# EAGLE design Pico board (EAGLE 7.5.0)
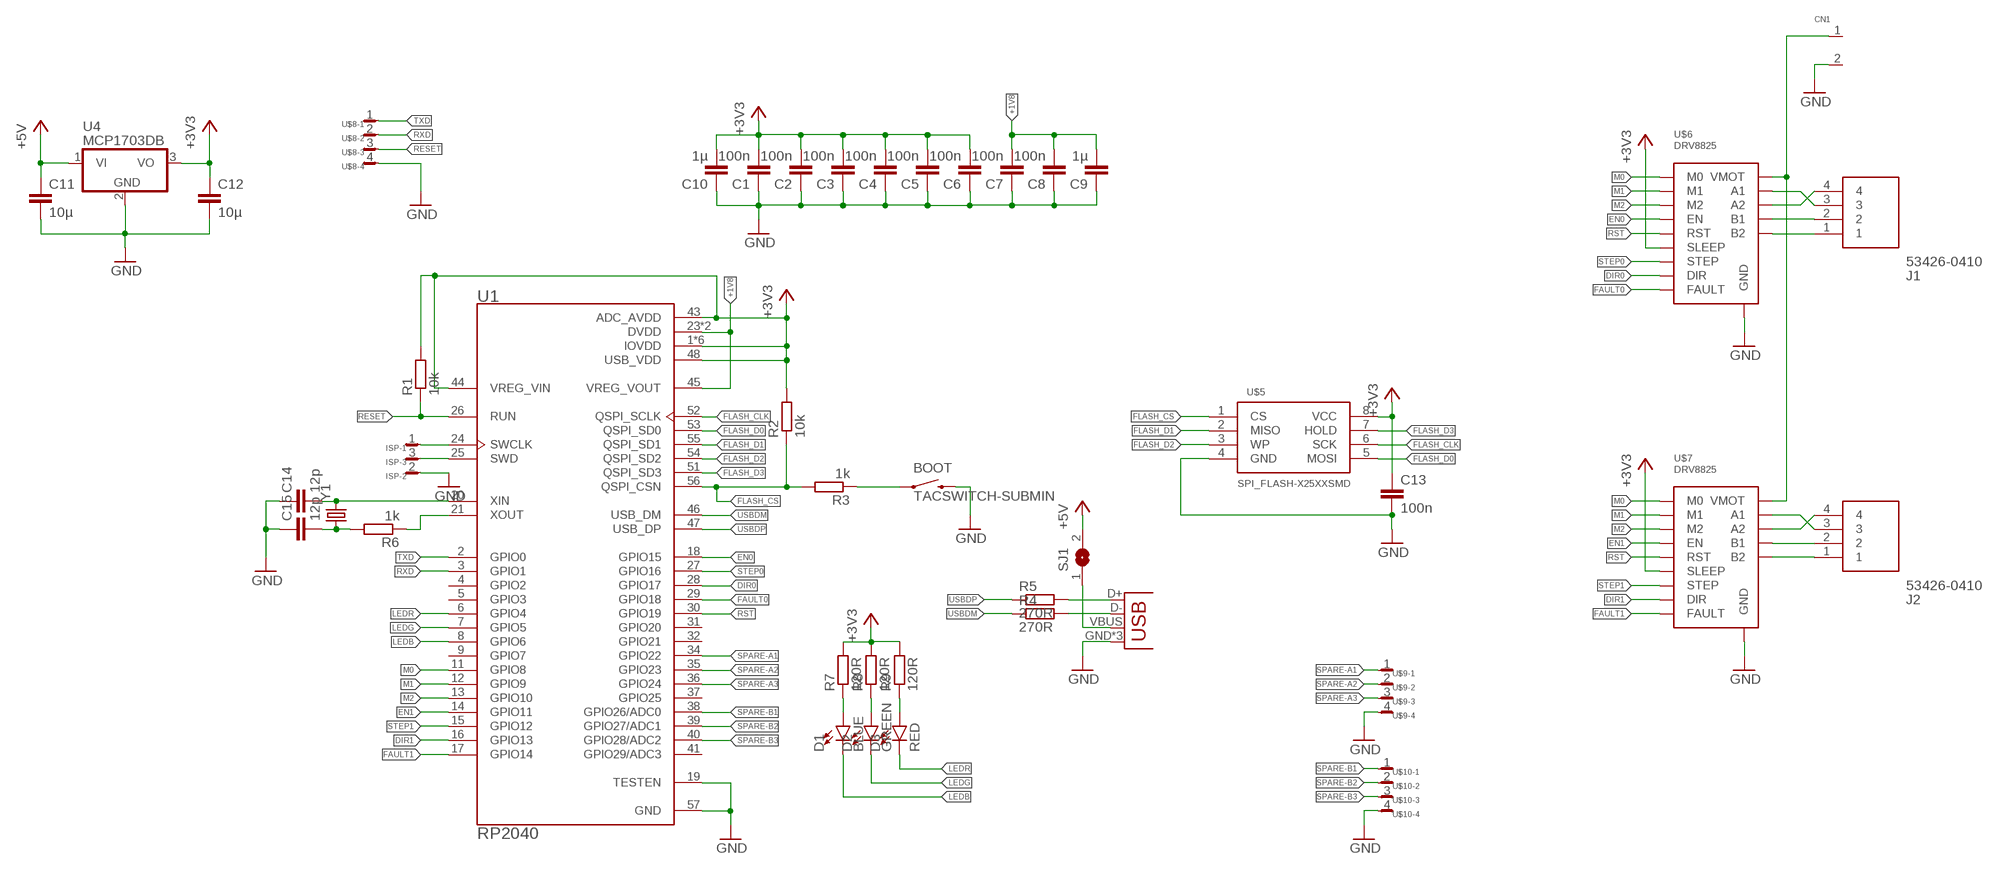
[diagram p0: schematic, sheet 1]

## Parts
BOOT  TACSWITCH-SUBMIN  [TACSWITCH_SUBMIN]
C1  100n  C-EUC0402K  [C0402K]
C2  100n  C-EUC0402K  [C0402K]
C3  100n  C-EUC0402K  [C0402K]
C4  100n  C-EUC0402K  [C0402K]
C5  100n  C-EUC0402K  [C0402K]
C6  100n  C-EUC0402K  [C0402K]
C7  100n  C-EUC0402K  [C0402K]
C8  100n  C-EUC0402K  [C0402K]
C9  1µ  C-EUC0603K  [C0603K]
C10  1µ  C-EUC0603K  [C0603K]
C11  10µ  C-EUC1206K  [C1206K]
C12  10µ  C-EUC1206K  [C1206K]
C13  100n  C-EUC0402K  [C0402K]
C14  12p  C-EUC0402K  [C0402K]
C15  12p  C-EUC0402K  [C0402K]
CN1  2PIN_SCREW_TRM  [CONN2P]
D1  BLUE  LED-BLUE0603  [LED-0603]
D2  GREEN  LED-GREEN0603  [LED-0603]
D3  RED  LED-RED0603  [LED-0603]
ISP  SM03B-SRSS-TB  [SM03B-SRSS-TB]
J1  53426-0410  [SHDRRA4W55P0X250_1X4_1240X1150]
J2  53426-0410  [SHDRRA4W55P0X250_1X4_1240X1150]
JP1  USB-MICROB  [USB-MICROB]
R1  10k  R-EU_R0402-*  [R0402]
R2  10k  R-EU_R0402-*  [R0402]
R3  1k  R-EU_R0402-*  [R0402]
R4  270R  R-EU_R0402-*  [R0402]
R5  270R  R-EU_R0402-*  [R0402]
R6  1k  R-EU_R0402-*  [R0402]
R7  120R  R-EU_R0402-*  [R0402]
R8  120R  R-EU_R0402-*  [R0402]
R9  120R  R-EU_R0402-*  [R0402]
SJ1  SJ  [SJ]
U1  RP2040  [QFN40P700X700X90-57N]
U4  MCP1703DB  [SOT223]
U$5  SPI_FLASH-X25XXSMD  [SO08]
U$6  DRV8825  POLOLU  [POLOLU]
U$7  DRV8825  POLOLU  [POLOLU]
U$8  SM04B-SRSS-TB  [SM04B-SRSS-TB]
U$9  SM04B-SRSS-TB  [SM04B-SRSS-TB]
U$10  SM04B-SRSS-TB  [SM04B-SRSS-TB]
Y1  CRYSTAL5X3  [CRYSTAL-SMD-5X3]

## Nets
+1V8: C7.2 C8.2 C9.2 U1.23(DVDD) U1.45(VREG_VOUT) U1.50(DVDD)
+3V3: C1.2 C2.2 C3.2 C4.2 C5.2 C6.2 C10.2 C12.1 C13.1 R1.2 R2.2 R7.2 R8.2 R9.2 U1.1(IOVDD) U1.10(IOVDD) U1.22(IOVDD) U1.33(IOVDD) U1.42(IOVDD) U1.43(ADC_AVDD) U1.44(VREG_VIN) U1.48(USB_VDD) U1.49(IOVDD) U4.3(VO) U$5.8(VCC) U$6.SLEEP U$7.SLEEP
+5V: C11.1 SJ1.2 U4.1(VI)
DIR0: U1.28(GPIO17) U$6.DIR
DIR1: U1.16(GPIO13) U$7.DIR
EN0: U1.18(GPIO15) U$6.ENABLE(EN)
EN1: U1.14(GPIO11) U$7.ENABLE(EN)
FAULT0: U1.29(GPIO18) U$6.FAULT
FAULT1: U1.17(GPIO14) U$7.FAULT
FLASH_CLK: U1.52(QSPI_SCLK) U$5.6(SCK)
FLASH_CS: R2.1 R3.2 U1.56(QSPI_CSN) U$5.1(CS)
FLASH_D0: U1.53(QSPI_SD0) U$5.5(MOSI)
FLASH_D1: U1.55(QSPI_SD1) U$5.2(MISO)
FLASH_D2: U1.54(QSPI_SD2) U$5.3(WP)
FLASH_D3: U1.51(QSPI_SD3) U$5.7(HOLD)
GND: BOOT.-2 C1.1 C2.1 C3.1 C4.1 C5.1 C6.1 C7.1 C8.1 C9.1 C10.1 C11.2 C12.2 C13.2 C14.1 C15.1 CN1.2 ISP.2 JP1.GND JP1.MT1(GND) JP1.MT2(GND) U1.19(TESTEN) U1.57(GND) U4.2(GND) U$5.4(GND) U$6.GND@1(GND) U$6.GND@2(GND) U$7.GND@1(GND) U$7.GND@2(GND) U$8.4 U$9.4 U$10.4
LEDB: D1.C U1.8(GPIO6)
LEDG: D2.C U1.7(GPIO5)
LEDR: D3.C U1.6(GPIO4)
M0: U1.11(GPIO8) U$6.M0 U$7.M0
M1: U1.12(GPIO9) U$6.M1 U$7.M1
M2: U1.13(GPIO10) U$6.M2 U$7.M2
N$5 [power]: J1.3 U$6.A1
N$6: JP1.D+ R5.2
N$7: JP1.D- R4.2
N$8 [power]: J1.4 U$6.A2
N$9: BOOT.-1 R3.1
N$10 [power]: J2.2 U$7.B1
N$11 [power]: J2.1 U$7.B2
N$12 [power]: J2.3 U$7.A1
N$13 [power]: J2.4 U$7.A2
N$16: JP1.VBUS SJ1.1
N$17: ISP.1 U1.24(SWCLK)
N$18: ISP.3 U1.25(SWD)
N$19: C15.2 R6.2 Y1.1
N$20: R6.1 U1.21(XOUT)
N$21: C14.2 U1.20(XIN) Y1.3
N$22 [power]: J1.2 U$6.B1
N$23 [power]: J1.1 U$6.B2
N$25: D1.A R7.1
N$26: D2.A R8.1
N$27 [power]: CN1.1 U$6.VMOT U$7.VMOT
N$28: D3.A R9.1
RESET: R1.1 U1.26(RUN) U$8.3
RST: U1.30(GPIO19) U$6.RESET(RST) U$7.RESET(RST)
RXD: U1.3(GPIO1) U$8.2
SPARE-A1: U1.34(GPIO22) U$9.1
SPARE-A2: U1.35(GPIO23) U$9.2
SPARE-A3: U1.36(GPIO24) U$9.3
SPARE-B1: U1.38(GPIO26/ADC0) U$10.1
SPARE-B2: U1.39(GPIO27/ADC1) U$10.2
SPARE-B3: U1.40(GPIO28/ADC2) U$10.3
STEP0: U1.27(GPIO16) U$6.STEP
STEP1: U1.15(GPIO12) U$7.STEP
TXD: U1.2(GPIO0) U$8.1
USBDM: R4.1 U1.46(USB_DM)
USBDP: R5.1 U1.47(USB_DP)
Unconnected: U1.4(GPIO2) U1.5(GPIO3) U1.9(GPIO7) U1.31(GPIO20) U1.32(GPIO21) U1.37(GPIO25) U1.41(GPIO29/ADC3)

## Library data of the parts
BOOT = melanie:TACSWITCH-SUBMIN
C1-C15 = melanie:C-EU: CAPACITOR, European symbol
CN1 = melanie:2PIN_SCREW_TRM
D1 = SparkFun-LED:LED-BLUE: Blue SMD LED Used in manufacturing of various products at SparkFun Packages: 0603 - SMD 0603 package [Product Link] <http://www.digikey.com/product-detail/en/SMLE12BC7TT86/511-1589-2-ND/1641808> 1206 - SMD1206 package [Product Link] <http://www.digikey.com/product-detail/en/lite-on-inc/LTST-C150TBKT/160-1643-1-ND/573584> SparkFun Products: ESP8266 Thing-Dev Board <https://www.sparkfun.com/products/13711> RedBoard <https://www.sparkfun.com/products/12757>; PROD_ID: DIO-08575
D2 = SparkFun-LED:LED-GREEN: Green SMD LED Used in manufacturing of various products at SparkFun Packages: 0603 - SMD 0603 package [Product Link] <http://www.futureelectronics.com/en/technologies/semiconductors/optoelectronics/leds/Pages/9894312-LTST-C190GKT.aspx?CrossPart=HSMG-C190&IM=0> LilyPad 1206 - SMD1206 LilyPad package [Product Link] <http://www.futureelectronics.com/en/Technologies/Product.aspx?ProductID=IN150NGHARVATEKCORPORATION2049943&IM=0> 1206 - SMD1206 package [Product Link] <http://www.futureelectronics.com/en/technologies/semiconductors/optoelectronics/leds/Pages/8315665-LTST-C150KGKT.aspx?IM=0> 1206 Bottom Mount -SMD 1206 Bottom Mount [Product Link] <http://www.digikey.com/product-detail/en/lite-on-inc/LTST-C230KGKT/160-1456-1-ND/386854> SparkFun Products: Pro Mini 328 -5V <https://www.sparkfun.com/products/821> RedBoard <https://www.sparkfun.com/products/12757> MP3 Trigger <https://www.sparkfun.com/products/13720> Makey Makey <https://www.sparkfun.com/products/11076>; PROD_ID: DIO-00821
D3 = SparkFun-LED:LED-RED: Red SMD LED Used in manufacturing of most products at SparkFun Packages: 0603 - SMD 0603 package [Product Link] <http://docs.avagotech.com/docs/AV02-0551EN> 0603 SMART - SMD 0603 SMART package ( more efficient and expensive)[Product Link] <http://www.osram-os.com/Graphics/XPic2/00077099_0.pdf> 1206 - SMD1206 package [Product Link] <https://www.sparkfun.com/datasheets/DevTools/LilyPad/Q150OVS4.pdff> SparkFun Products: Pro Mini 328 -5V <https://www.sparkfun.com/products/821> RedBoard <https://www.sparkfun.com/products/12757> IOIO-OTG <https://www.sparkfun.com/products/13613>; PROD_ID: DIO-00819
ISP = con-JST-SH:SM03B-SRSS-TB
J1 J2 = 53426-0410:53426-0410: Headers & Wire Housings 2.5 WTB WAFER ASSY RA W/KINK 4CKT Source: Datasheet <https://www.molex.com/pdm_docs/sd/534260410_sd.pdf>; DESCRIPTION: Headers & Wire Housings 2.5 WTB WAFER ASSY RA W/KINK 4CKT; HEIGHT: 6.9mm; MANUFACTURER_NAME: Molex; MANUFACTURER_PART_NUMBER: 53426-0410; MOUSER_PART_NUMBER: 538-53426-0410; MOUSER_PRICE-STOCK: https://www.mouser.co.uk/ProductDetail/Molex/53426-0410?qs=9BfFgGvh7CdBwfW5YnFZ7w%3D%3D
JP1 = SparkFun-Connectors:USB: USB Connectors USB-B-PTH is fully proven SKU : PRT-00139/CONN-08278 USB-miniB is fully proven SKU : PRT-00587 USB-A-PCB is untested. USB-A-H is throughly reviewed, but untested. Spark Fun Electronics SKU : PRT-00437 USB-B-SMT is throughly reviewed, but untested. Needs silkscreen touching up. USB-A-S has not been used/tested USB-MB-H has not been used/tested USB-MICROB has been used. CONN-09505; PROD_ID: CONN-09505
R1-R9 = melanie:R-EU_: RESISTOR, European symbol
SJ1 = jumper:SJ: SMD solder JUMPER
U1 = RP2040:RP2040: Check availability <https://pricing.snapeda.com/parts/RP2040/Raspberry%20Pi/view-part?ref=eda>; AVAILABILITY: In Stock; CHECK_PRICES: https://www.snapeda.com/parts/RP2040/Raspberry+Pi/view-part/?ref=eda; DESCRIPTION: RP2040 chip for Raspberry Pi Pico - ARM® Cortex®-M0+ MCU 32-Bit; MF: Raspberry Pi; MP: RP2040; PACKAGE: None; PRICE: None; PURCHASE-URL: https://www.snapeda.com/api/url_track_click_mouser/?unipart_id=5800506&manufacturer=Raspberry Pi&part_name=RP2040&search_term=None; SNAPEDA_LINK: https://www.snapeda.com/parts/RP2040/Raspberry+Pi/view-part/?ref=snap
U4 = linear:MCP1703: 250 mA, 16V, Low Quiescent Current LDO Regulator Source: http://ww1.microchip.com/downloads/en/DeviceDoc/22049b.pdf
U$5 = SparkFun-DigitalIC:SPI_FLASH-X25XX: 8pin SPI Flash series x25xx. Works with devices like W25X32 and BR25L32
U$6 U$7 = melanie:POLOLU
U$8-U$10 = con-JST-SH:SM04B-SRSS-TB
Y1 = SparkFun-FreqCtrl:CRYSTAL: Various standard crystals. Proven footprints. Spark Fun Electronics SKU : COM-00534

## Net classes
1 power: width 1 mm

## Board
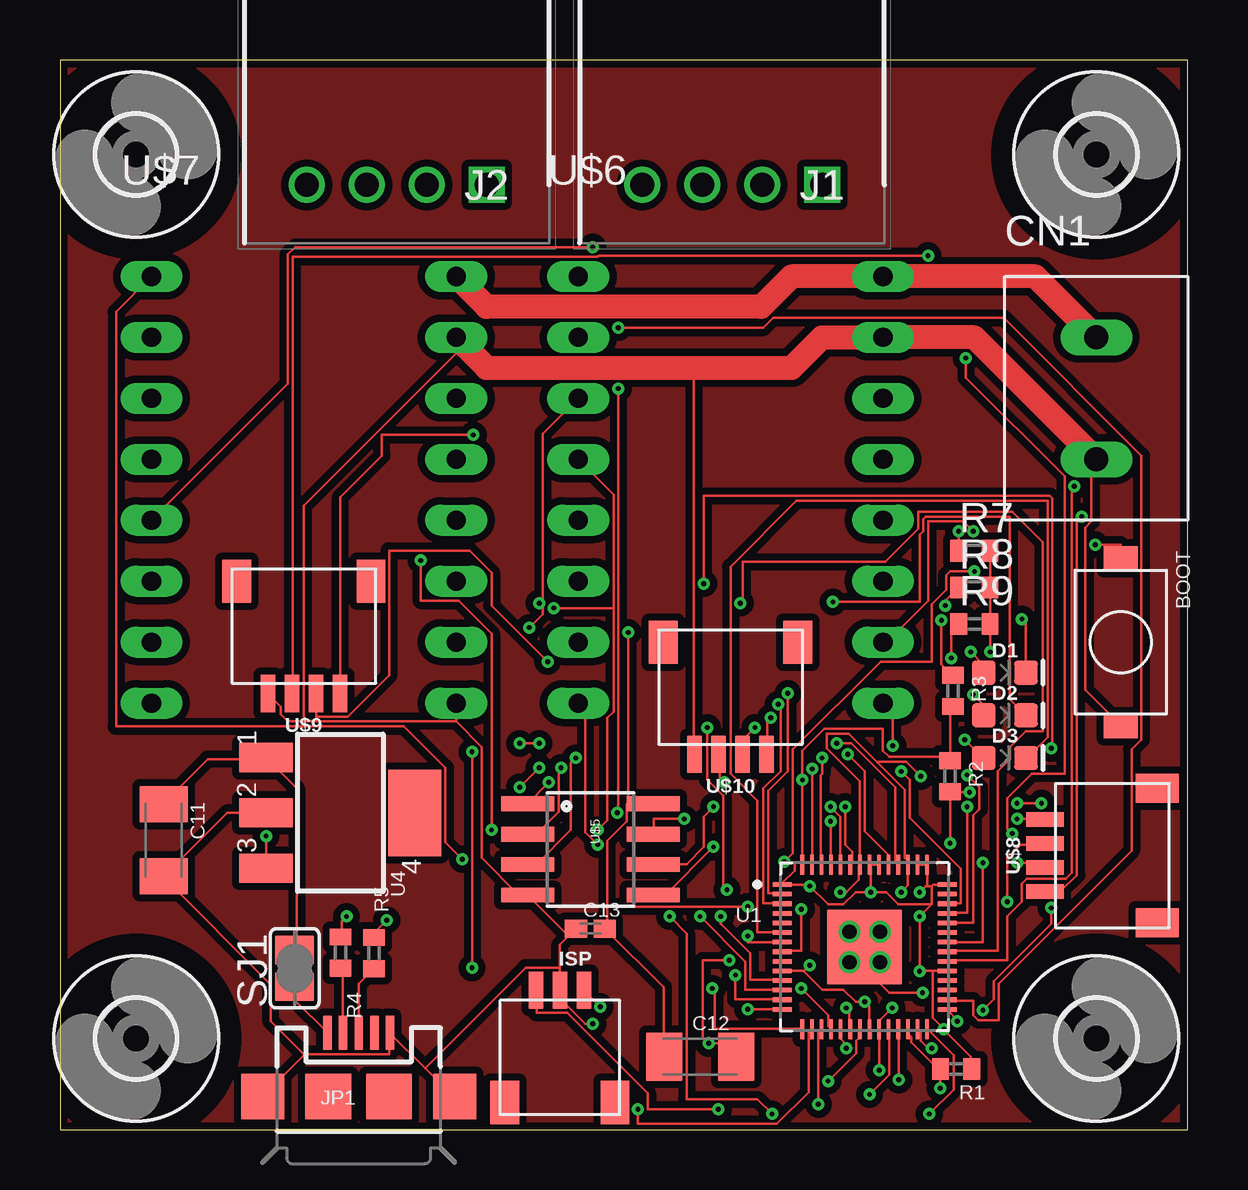
[diagram p1: board, top side]
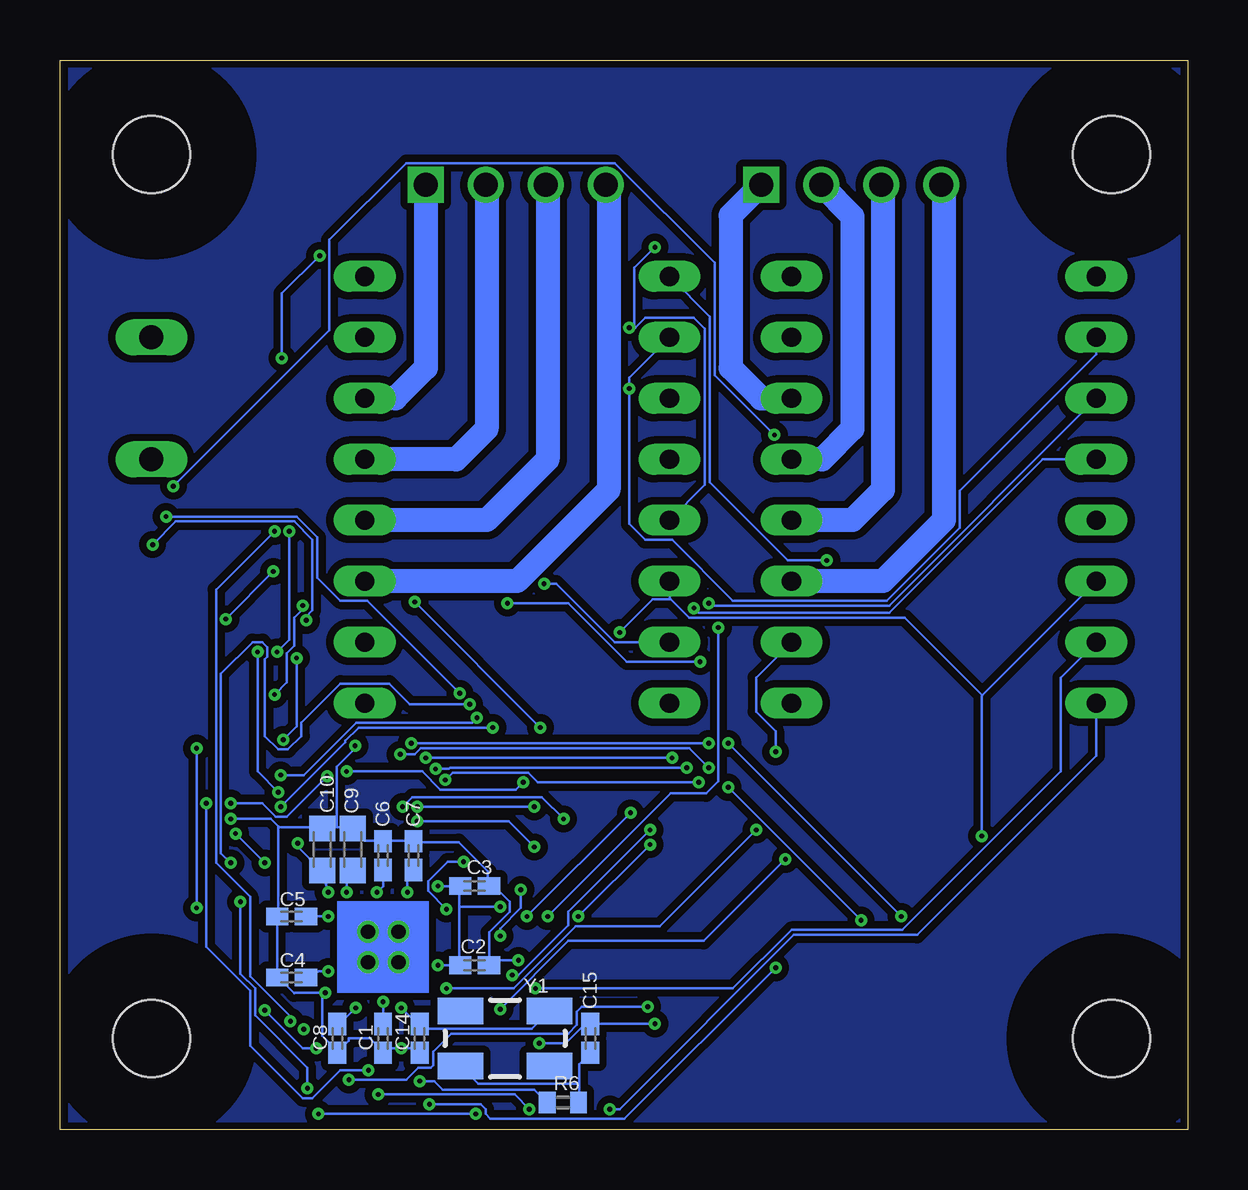
[diagram p2: board, bottom side, seen from below]

Size 46.99 x 44.58 mm. Coordinates in mm from the lower left corner, seen from the top.
Outline: 0,0 46.99,0 46.99,44.58 0,44.58 0,0
Copper layers (1*16): Top 0.035mm / dielectric 1.5mm / Bottom 0.035mm
Design rules "aisler_2_layer": minimum track width 0.1mm, minimum drill 0.2mm, track to track 0.1mm, track to pad 0.1mm, pad to pad 0.1mm, via to via 0.1mm, smd to smd 0.1mm, copper to edge 0.2mm, drill to drill 0.21mm, minimum pad ring 0.25mm, minimum via ring 0.15mm, stop-mask expansion 0mil, vias tented up to drill 0mil, thermal gap 10mil

### Footprints (pad centres in the part's own frame; a part is rotated, then mirrored left to right if it is on the bottom)
TACSWITCH_SUBMIN = smd 1 x 1.4: -1 -3.5,0; -2 3.5,0
C0402K = smd 0.925 x 0.74: 1 -0.6,0; 2 0.6,0
C0603K = smd 1.05 x 1.08: 1 -0.875,0; 2 0.875,0
C1206K = smd 1.5 x 2: 1 -1.5,0; 2 1.5,0
CONN2P = drill 1 long: 1 0,2.54; 2 0,-2.54
LED-0603 = smd 1 x 1: A -0.877,0; C 0.877,0
SM03B-SRSS-TB = smd 0.6 x 1.55: 1 -1,4.675; 2 0,4.675; 3 1,4.675 | smd 1.2 x 1.8: M1 2.3,0; M2 -2.3,0
SHDRRA4W55P0X250_1X4_1240X1150 = drill 1 pad 1.5 square: 1 0,0 | drill 1 pad 1.5: 2 -2.5,0; 3 -5,0; 4 -7.5,0
USB-MICROB = smd 0.35 x 1.4: D+ 0,2.65; D- -0.65,2.65; GND 1.3,2.65; ID 0.65,2.65; VBUS -1.3,2.65 | smd 1.8 x 1.9: MT1 -4,0; MT2 4,0 | smd 1.9 x 1.9: P$1 -1.27,0; P$2 1.27,0
R0402 = smd 0.7 x 0.9: 1 -0.65,0; 2 0.65,0
SJ = smd 1.168 x 1.6: 1 -0.762,0; 2 0.762,0
QFN40P700X700X90-57N = smd 0.84 x 0.2: 1 -3.435,2.6; 2 -3.435,2.2; 3 -3.435,1.8; 4 -3.435,1.4; 5 -3.435,1; 6 -3.435,0.6; 7 -3.435,0.2; 8 -3.435,-0.2; 9 -3.435,-0.6; 10 -3.435,-1; 11 -3.435,-1.4; 12 -3.435,-1.8; 13 -3.435,-2.2; 14 -3.435,-2.6; 29 3.435,-2.6; 30 3.435,-2.2; 31 3.435,-1.8; 32 3.435,-1.4; 33 3.435,-1; 34 3.435,-0.6; 35 3.435,-0.2; 36 3.435,0.2; 37 3.435,0.6; 38 3.435,1; 39 3.435,1.4; 40 3.435,1.8; 41 3.435,2.2; 42 3.435,2.6 | smd 0.2 x 0.84: 15 -2.6,-3.435; 16 -2.2,-3.435; 17 -1.8,-3.435; 18 -1.4,-3.435; 19 -1,-3.435; 20 -0.6,-3.435; 21 -0.2,-3.435; 22 0.2,-3.435; 23 0.6,-3.435; 24 1,-3.435; 25 1.4,-3.435; 26 1.8,-3.435; 27 2.2,-3.435; 28 2.6,-3.435; 43 2.6,3.435; 44 2.2,3.435; 45 1.8,3.435; 46 1.4,3.435; 47 1,3.435; 48 0.6,3.435; 49 0.2,3.435; 50 -0.2,3.435; 51 -0.6,3.435; 52 -1,3.435; 53 -1.4,3.435; 54 -1.8,3.435; 55 -2.2,3.435; 56 -2.6,3.435 | smd 3.1 x 3.1: 57 0,0
SOT223 = smd 1.219 x 2.235: 1 -2.311,-3.099; 2 0,-3.099; 3 2.311,-3.099 | smd 3.6 x 2.2: 4 0,3.099
3,2 = hole 3.2: 0,0
SO08 = smd 0.61 x 2.21: 1 -1.905,-2.616; 2 -0.635,-2.616; 3 0.635,-2.616; 4 1.905,-2.616; 5 1.905,2.616; 6 0.635,2.616; 7 -0.635,2.616; 8 -1.905,2.616
POLOLU = drill 0.8 long: A1 6.35,-2.54; A2 6.35,-5.08; B1 6.35,0; B2 6.35,2.54; DIR -6.35,-10.16; ENABLE -6.35,7.62; FAULT 6.35,-7.62; GND@1 6.35,5.08; GND@2 6.35,-10.16; M0 -6.35,5.08; M1 -6.35,2.54; M2 -6.35,0; RESET -6.35,-2.54; SLEEP -6.35,-5.08; STEP -6.35,-7.62; VMOT 6.35,7.62
SM04B-SRSS-TB = smd 0.6 x 1.55: 1 -1.5,4.675; 2 -0.5,4.675; 3 0.5,4.675; 4 1.5,4.675 | smd 1.2 x 1.8: M1 2.8,0; M2 -2.8,0
CRYSTAL-SMD-5X3 = smd 1.9 x 1.1: 1 -1.85,-1.15; 2 1.85,-1.15; 3 1.85,1.15; 4 -1.85,1.15

### Placement (x,y rotation side)
BOOT  44.2,20.32 270 top
C1  33.53,3.81 90 bottom
C2  29.72,6.86 180 bottom
C3  29.72,10.16 180 bottom
C4  37.34,6.35 0 bottom
C5  37.34,8.89 0 bottom
C6  33.53,11.43 270 bottom
C7  32.26,11.43 270 bottom
C8  35.43,3.81 90 bottom
C9  34.8,11.68 270 bottom
C10  36.07,11.68 270 bottom
C11  4.32,12.06 270 top
C12  26.67,3.05 0 top
C13  22.1,8.38 180 top
C14  32,3.81 90 bottom
C15  24.89,3.81 270 bottom
CN1  43.18,30.48 0 top
D1  39.37,19.05 0 top
D2  39.37,17.27 0 top
D3  39.37,15.49 0 top
ISP  20.83,1.14 0 top
J1  31.75,39.37 0 top
J2  17.78,39.37 0 top
JP1  12.45,1.4 0 top
R1  37.34,2.54 0 top
R2  37.08,14.73 270 top
R3  37.21,18.29 270 top
R4  11.68,7.38 270 top
R5  13.08,7.37 270 top
R6  26.04,1.14 0 bottom
R7  38.1,24.13 0 top
R8  38.1,22.61 0 top
R9  38.1,21.08 0 top
SJ1  9.78,6.73 90 top
U1  33.53,7.62 0 top
U4  11.68,13.21 270 top
U$1  [3,2]  43.18,40.64 0 top
U$2  [3,2]  3.18,40.64 0 top
U$3  [3,2]  43.18,3.81 0 top
U$4  [3,2]  3.18,3.81 0 top
U$5  22.1,11.68 270 top
U$6  27.94,27.94 0 top
U$7  10.16,27.94 0 top
U$8  45.72,11.43 90 top
U$9  10.16,22.86 180 top
U$10  27.94,20.32 180 top
Y1  28.45,3.81 0 bottom

### Tracks (layer width: path | path; a pad name or v marks a point on that pad's centre or on a via)
+1V8  (via drill 0.2)
  Top 0.1: v32.51,9.91 32.77,9.91 33.27,10.41 33.27,11 U1.50 | v35.05,9.91 35.33,10.18 U1.45 | 35.31,11.18 U1.45 | 33.4,11.18 U1.50 | v34.67,5.08 34.16,4.57 34.16,4.19 U1.23 | 34.16,4.06 U1.23 | 34.06,15.32 32.87,16.51 31.95,16.51 31.95,15.9 33.33,14.53 33.33,11.12 U1.50 | 34.06,15.32 35.2,14.17 35.2,11.33 35.31,11.23 U1.45 | v34.14,2.49 34.14,4.06 U1.23 | v39.88,13.61 v40.89,13.61 | v35.87,14.73 35.26,15.34 34.09,15.34 34.06,15.32
  Bottom 0.1: 32.51,10.16 v32.51,9.91 32.51,10.58 C7.2 32.26,10.92 | v35.05,9.91 35.05,10.55 C9.2 34.8,10.92 | v34.67,5.08 35.43,4.32 C8.2 | v34.14,2.49 35.31,2.49 36.47,1.32 36.88,1.32 39.07,3.5 39.07,5.79 40.89,7.62 v40.89,13.61 | v39.88,13.61 38.56,13.61 38,13.06 37.54,13.06 v35.87,14.73
+3V3  (via drill 0.2)
  Top 0.1: v33.78,9.91 33.78,11 U1.49 U1.48 34.16,11.18 | v35.81,9.91 36.07,10.16 | 36.07,10.16 36.13,10.22 U1.43 U1.44 | 36.32,9.4 v35.81,8.89 v35.81,6.6 35.83,6.62 36.37,6.62 | 36.32,9.4 36.32,10.16 | 36.32,10.16 36.38,10.22 U1.42 | 36.37,6.62 U1.33 37.08,6.6 | v31.24,6.86 31,6.62 30.99,6.62 | 30.99,6.62 U1.10 | 36.07,10.16 36.32,10.16 | v33.78,9.91 34.42,9.91 34.93,9.4 36.32,9.4 | v33.78,9.91 33.15,9.91 32.64,9.4 32,9.4 v31.24,10.16 31.18,10.22 U1.1 30.1,10.29 30.61,10.79 30.61,11.05 | 30.99,6.62 30.99,6.6 31.75,5.84 32.64,5.84 33.15,5.33 v33.53,5.33 33.73,5.13 U1.22 33.78,4.06 33.78,3.81 | v8.59,12.24 U4.3 | C12.1 25.15,3.05 25.15,5.94 C13.1 22.81,8.33 22.81,9.3 | 23.67,13.56 23.62,13.56 23.62,12.85 22.81,12.04 22.81,9.3 | 23.67,13.56 24.69,13.56 U$5.8 23.67,13.56 | R8.2 R9.2 | R8.2 R7.2 | R8.2 | R1.2 37.95,2.54 37.95,3.05 36.83,4.17 v36.83,4.19 36.83,4.22 36.37,4.67 36.37,6.62 | v37.08,11.94 R2.2 | v38.76,19.91 R9.2 | R2.2 v37.9,14.07 | R9.2 | R2.2 | v28.65,9.3 22.81,9.3 | 23.67,13.56 v23.67,20.73
  Bottom 0.1: C6.2 33.53,10.16 v33.78,9.91 | C10.2 v35.81,9.91 | C5.2 v35.81,8.89 | v35.81,6.6 36.21,6.6 C4.2 36.83,6.35 | C1.2 v33.53,5.33 | 30.35,6.86 v31.24,6.86 | 30.35,10.16 v31.24,10.16 | 30.35,10.16 30.35,9.3 | 30.35,9.3 30.35,6.86 | 30.35,6.86 C2.2 30.23,6.86 | 30.35,10.16 C3.2 30.23,10.16 | 35.94,10.41 C10.2 | v8.59,12.24 8.59,18.09 8.56,18.11 | U$7.SLEEP 8.56,18.11 | U$6.SLEEP 21.59,22.15 21.57,22.12 | 21.57,22.12 20.78,21.34 11.79,21.34 8.56,18.11 | v37.08,11.94 37.08,11.79 36.12,10.82 C10.2 | v38.76,19.91 38.76,14.94 v37.9,14.07 | 30.35,9.3 v28.65,9.3 | v23.67,20.73 22.3,22.1 21.59,22.1 21.57,22.12
+5V
  Top 0.1: SJ1.2 9.86,7.57 9.86,14.22 8.59,15.49 U4.1 8.59,15.44 6.15,15.44 4.32,13.61 C11.1
DIR0  (via drill 0.2)
  Top 0.1: v36.22,0.66 37.24,1.68 37.24,3.1 36.17,4.17 U1.28 | v29.67,0.66 29.06,1.27 26.11,1.27 26.11,8.18 v25.4,8.89 | v22.4,11.89 21.9,12.39 21.9,17.48 U$6.DIR
  Bottom 0.1: v29.67,0.66 v36.22,0.66 | v22.4,11.89 v25.4,8.89
DIR1  (via drill 0.2)
  Top 0.1: v24.08,0.86 24.08,0.25 29.87,0.25 31.19,1.57 31.19,4.06 31.29,4.17 U1.16
  Bottom 0.1: v24.08,0.86 23.67,0.86 16.41,8.13 11.28,8.13 3.81,15.6 U$7.DIR
EN0  (via drill 0.2)
  Top 0.1: v30.89,5.89 32,4.78 32,4.32 32.11,4.22 U1.18 | v17.98,12.5 17.98,20.68 16.61,22.05 15.04,22.05 v15.04,23.72
  Bottom 0.1: v30.89,5.89 28.09,5.89 25.5,8.48 22,8.48 v17.98,12.5 | v15.04,23.72 16.66,23.72 19.91,26.98 19.91,33.88 U$6.ENABLE
EN1  (via drill 0.2)
  Top 0.1: v28.65,5.03 30.07,5.03 U1.14 | v16.76,11.28 16.05,11.99 16.05,15.09 14.33,16.82 2.34,16.82 2.34,34.09 U$7.ENABLE
  Bottom 0.1: v28.65,5.03 25.81,7.87 20.17,7.87 v16.76,11.28
FAULT0  (via drill 0.2)
  Top 0.1: v37.39,4.52 37.39,4.57 36.98,4.98 U1.29 | v38.05,24.94 37.64,25.35 36.17,25.35 36.17,22.05 34.44,20.32 U$6.FAULT
  Bottom 0.1: v37.39,4.52 37.39,4.72 39.07,6.4 39.07,9.7 40.49,11.12 40.49,22.5 v38.05,24.94
FAULT1  (via drill 0.2)
  Top 0.1: v31.6,1.07 31.6,4.06 31.7,4.17 U1.17 | v17.17,15.75 v17.17,6.76
  Bottom 0.1: v31.6,1.07 29.46,1.07 29.26,0.86 29.26,0.66 29.06,0.46 23.47,0.46 v17.17,6.76 | v17.17,15.75 17.17,16.61 17.98,17.42 17.98,18.85 U$7.FAULT
FLASH_CLK  (via drill 0.2)
  Top 0.1: v32.11,13.46 32.51,13.06 32.51,11.18 U1.52 | v27.23,13.46 26.82,13.06 26.82,11.79 26.11,11.07 24.74,11.07 U$5.6
  Bottom 0.1: v27.23,13.46 v32.11,13.46
FLASH_CS  (via drill 0.2)
  Top 0.1: 37.08,15.54 34.54,15.54 34.29,15.8 34.29,16.71 31.85,16.71 30.94,15.8 v30.94,14.58 30.94,11.07 U1.56 | 37.08,15.54 R2.1 37.08,15.39 | 37.08,15.54 37.08,17.53 37.19,17.63 R3.2 | v20.37,14.48 U$5.1
  Bottom 0.1: v20.37,14.48 27.08,14.48 27.48,14.88 30.63,14.88 v30.94,14.58
FLASH_D0  (via drill 0.2)
  Top 0.1: 32.13,11.18 U1.53 32.11,11.18 v32.11,12.85 | v27.23,11.79 25.25,9.8 24.74,9.8 U$5.5
  Bottom 0.1: v32.11,12.85 28.3,12.85 v27.23,11.79
FLASH_D1  (via drill 0.2)
  Top 0.1: v31.34,15.04 31.34,11.07 U1.55 | v20.88,15.09 20.78,14.99 20.78,13.26 19.86,12.34 19.51,12.34 U$5.2
  Bottom 0.1: v31.34,15.04 30.79,15.04 30.73,15.09 v20.88,15.09
FLASH_D2  (via drill 0.2)
  Top 0.1: 31.75,11.18 U1.54 31.75,11.23 31.7,11.28 31.7,14.78 31.75,14.83 v31.75,15.49 | v21.49,15.49 21.29,15.29 21.29,12.5 19.86,11.07 19.51,11.07 U$5.3
  Bottom 0.1: v21.49,15.49 v31.75,15.49
FLASH_D3  (via drill 0.2)
  Top 0.1: U1.51 33.02,11.18 33.02,11.58 32.72,11.89 v32.72,13.46 | v26.01,12.95 24.74,12.95 24.74,12.34 U$5.7
  Bottom 0.1: v32.72,13.46 32.31,13.87 26.92,13.87 v26.01,12.95
GND  (via drill 0.2)
  Top 0.1: 32.51,4.57 32.51,4.19 U1.19 | 32.51,3.81 32.51,4.06 U1.19 | U1.57 33.53,6.73 34.54,5.71 v35.94,5.71 | BOOT.-2 44.2,16.87 42.72,18.34 42.72,25.09 42.98,25.35 42.98,27.48 CN1.2 | 26.42,31.75 26.42,15.65 U$10.4 | 32.51,3.81 32.77,3.56 v32.77,3.4 | 32.51,3.81 U1.19 | v39.88,12.95 41,12.95 U$8.4 | U$6.GND@2 34.7,17.37 v34.7,16 | U4.2 6.96,13.21 C11.2 4.32,10.52 8.79,6.04 8.79,4.52 10.19,3.12 | 15.22,2.56 16.41,1.37 JP1.MT2 | 15.22,2.56 13.77,4.01 JP1.GND 13.72,4.01 13.72,3.15 10.21,3.15 10.19,3.12 | 10.19,3.12 8.48,1.42 JP1.MT1 | 16.51,17.02 10.16,17.02 | 10.16,17.02 9.5,17.02 9.2,17.32 9.2,17.63 8.69,18.14 U$9.4 | U$7.GND@2 16.51,17.02 | C12.2 28.14,3.05 28.14,3.61 v27.03,3.61 26.77,3.86 26.77,7.06 v27.89,7.06 | 20.83,6.76 ISP.2 20.83,5.49 21.9,4.42 v22.2,4.42 | 20.83,6.76 20.83,7.72 21.49,8.38 C13.2 21.13,8.08 21.13,8.13 U$5.4 19.46,9.8 19.1,9.8 17.58,11.33 17.58,15.95 16.51,17.02 | 15.22,2.56 19.41,6.76 20.83,6.76 | 16.84,32.69 10.16,26.01 10.16,17.02
  Top 1: CN1.2 38.1,33.02 U$6.GND@1 31.75,33.02 30.48,31.75 26.42,31.75 17.78,31.75 16.84,32.69 U$7.GND@1
  Bottom 0.1: 36.07,5.71 37.21,5.71 37.24,5.69 37.9,6.35 C4.1 C5.1 37.9,8.89 37.9,12.6 37.87,12.62 | 36.07,5.71 36.07,3.91 35.41,3.25 | 36.07,5.71 v35.94,5.71 | 34.09,3.81 34.95,3.81 34.95,3.71 35.41,3.25 | 34.09,3.81 34.04,3.81 | C14.1 32,3.25 32.16,3.4 v32.77,3.4 33.63,3.4 C1.1 33.53,3.25 34.09,3.81 | 35.41,3.25 C8.1 | 29.11,7.06 29.11,8.23 28.25,9.09 28.25,9.5 28.91,10.16 C3.1 29.16,10.16 29.16,10.77 30.38,11.99 32.26,11.99 C7.1 C6.1 | 29.11,7.06 29.11,6.86 C2.1 29.11,7.06 | 36.07,12.6 35.46,12.6 | 35.46,12.6 34.8,12.6 C9.1 34.8,12.55 34.29,12.04 C6.1 | C6.1 | v39.88,12.95 38.2,12.95 37.87,12.62 | 37.87,12.62 37.85,12.6 36.07,12.6 | 36.07,12.6 C10.1 | v34.7,16 34.7,15.9 35.46,15.14 35.46,12.6 | v27.03,3.61 25.91,3.61 25.15,4.37 24.89,4.37 C15.1 v22.2,4.42 | v27.89,7.06 29.11,7.06
LEDB  (via drill 0.2)
  Top 0.1: v30.89,9.2 30.89,7.47 30.12,7.47 U1.8 | v30.18,11.18 30.53,11.53 30.53,15.85 34.19,19.51 36.32,19.51 36.32,21.89 36.93,22.5 36.93,23.11 37.08,23.27 v38.1,23.27 | v40.08,21.29 40.23,21.13 40.23,19.05 D1.C
  Bottom 0.1: v30.89,9.2 31.65,9.96 31.65,10.36 30.84,11.18 v30.18,11.18 | v40.08,21.29 v38.1,23.27
LEDG  (via drill 0.2)
  Top 0.1: v28.65,8.08 28.65,7.82 30.07,7.82 U1.7 | v27.79,10.01 27.63,10.16 27.63,13.92 26.98,14.58 v26.98,16.76 | v32.21,22 35.81,22 35.81,24.79 35.97,24.94 35.97,25.45 36.07,25.55 39.57,25.55 39.57,17.93 40.23,17.27 D2.C
  Bottom 0.1: v28.65,8.08 28.65,8.38 27.79,9.25 v27.79,10.01 | v32.21,22 v26.98,16.76
LEDR
  Top 0.1: U1.6 30.07,8.23 29.06,8.23 29.06,13.72 27.94,14.83 27.94,23.47 30.68,26.21 41.15,26.21 41.15,16.36 40.28,15.49 D3.C
M0  (via drill 0.2)
  Top 0.1: v27.53,8.89 27.53,8.59 28.75,7.37 28.75,6.25 30.07,6.25 U1.11 | v23.22,13.21 23.27,13.26 v23.27,30.89
  Bottom 0.1: v23.22,13.21 v27.53,8.89 | U$6.M0 23.27,31.34 v23.27,30.89 23.27,25.25 22.61,24.59 21.49,24.59 18.95,22.05 12.55,22.05 9.5,25.09 9.5,26.62 3.81,32.31 U$7.M0
M1  (via drill 0.2)
  Top 0.1: v26.67,8.89 28.55,7.01 28.55,5.84 30.07,5.84 U1.12 | v19.56,20.93 20.12,21.49 20.12,21.95 | 20.12,21.95 20.12,29.01 U$6.M1 | 20.12,21.95 v19.96,21.95
  Bottom 0.1: v26.67,8.89 21.54,14.02 20.07,14.02 19.56,14.53 v19.56,20.93 | U$7.M1 12.45,21.84 19.86,21.84 v19.96,21.95
M2  (via drill 0.2)
  Top 0.1: v28.14,6.45 28.14,5.44 30.07,5.44 U1.13 | v22.4,12.5 22.81,12.9 22.81,17.17 23.06,17.42 23.06,21.74 | 23.06,21.74 23.06,26.47 U$6.M2 | 23.06,21.74 v20.57,21.74
  Bottom 0.1: v28.14,6.45 27.89,6.45 25.81,8.53 25.81,9.09 v22.4,12.5 | U$7.M2 6.05,27.94 12.45,21.54 20.37,21.54 v20.57,21.74
N$1  (via drill 0.6)
  other vias: 32.89,8.26
N$2  (via drill 0.6)
  other vias: 34.16,8.26
N$3  (via drill 0.6)
  other vias: 34.16,6.99
N$4  (via drill 0.6)
  other vias: 32.89,6.99
N$5
  Bottom 1: J1.3 26.67,39.29 26.67,27.94 29.21,25.4 U$6.A1
N$6
  Top 0.1: JP1.D+ 12.45,6.1 13.06,6.71 R5.2
N$7
  Top 0.1: R4.2 11.73,6.71 11.79,6.66 11.79,4.06 JP1.D-
N$8
  Bottom 1: J1.4 24.13,39.25 24.13,26.67 27.94,22.86 U$6.A2
N$9  (via drill 0.2)
  Top 0.1: v36.73,21.23 36.73,19.41 37.19,18.95 R3.1 | v43.13,24.38 44.2,24.38 BOOT.-1
  Bottom 0.1: v36.73,21.23 36.73,21.39 36.47,21.64 36.47,24.59 37.24,25.35 42.16,25.35 v43.13,24.38
N$10
  Bottom 1: J2.2 13.97,38.06 13.97,29.21 15.24,27.94 U$7.B1
N$11
  Bottom 1: J2.1 19.05,38.1 19.05,31.75 17.78,30.48 U$7.B2
N$12
  Bottom 1: J2.3 12.7,39.29 12.7,26.67 13.97,25.4 U$7.A1
N$13
  Bottom 1: J2.4 10.16,39.25 10.16,25.4 12.7,22.86 U$7.A2
N$14
  pour Bottom (isolate 0.305): 0,0 46.61,0 46.61,44.45 0,44.45
N$15
  pour Top (isolate 0.305): 0,0 46.61,0 46.61,44.45 0,44.45
N$16
  Top 0.1: JP1.VBUS 11.12,4.06 9.8,5.38 9.8,5.94 SJ1.1
N$17  (via drill 0.2)
  Top 0.1: v33.73,1.47 34.54,2.29 34.54,4.06 U1.24 | v27.43,0.86 24.49,0.86 24.49,1.52 21.13,4.88 19.86,4.88 19.86,5.79 ISP.1
  Bottom 0.1: v33.73,1.47 28.04,1.47 v27.43,0.86
N$18  (via drill 0.2)
  Top 0.1: 34.93,4.06 U1.25 34.95,4.06 v34.95,2.08 | v22.5,5.13 21.84,5.79 ISP.3
  Bottom 0.1: v34.95,2.08 32.56,2.08 32.05,2.59 31.55,2.59 31.45,2.69 31.45,3.25 30.68,4.01 25.81,4.01 25.45,4.37 25.45,4.93 25.25,5.13 v22.5,5.13
N$19
  Bottom 0.1: 25.35,1.93 25.35,2.74 C15.2 | 25.35,1.93 25.35,1.17 R6.2 | 25.35,1.93 29.57,1.93 30.28,2.64 Y1.1
N$20  (via drill 0.2)
  Top 0.1: 33.27,3.81 33.27,4.06 U1.21 33.27,3.81 | 33.27,3.81 33.17,3.71 33.17,3.2 v32,2.03
  Bottom 0.1: v32,2.03 31.39,2.03 31.04,1.68 27.23,1.68 26.72,1.17 R6.1
N$21  (via drill 0.2)
  Top 0.1: v32.77,5.08 32.89,4.95 32.89,4.19 U1.20
  Bottom 0.1: 32,4.32 v32.77,5.08 | 32,4.32 31.88,4.19 C14.2 | 32,4.32 C14.2 | C14.2 31.85,4.22 27.33,4.22 26.62,4.93 Y1.3
N$22
  Bottom 1: J1.2 29.21,39.33 29.21,29.21 30.48,27.94 U$6.B1
N$23
  Bottom 1: J1.1 31.75,31.75 33.02,30.48 U$6.B2
N$25  (via drill 0.2)
  Top 0.1: v37.44,24.94 R7.1 | v37.95,19.91 38.46,19.41 38.46,19.05 D1.A
  Bottom 0.1: v37.44,24.94 37.44,20.42 v37.95,19.91
N$26  (via drill 0.2)
  Top 0.1: v36.88,21.84 36.88,22.05 R8.1 | v38.05,18.14 38.46,17.73 38.46,17.27 D2.A
  Bottom 0.1: v36.88,21.84 36.88,21.69 37.24,21.34 37.24,20.17 37.54,19.86 37.54,18.64 v38.05,18.14
N$27
  Top 1: CN1.1 40.64,35.56 U$6.VMOT 30.48,35.56 29.21,34.29 17.78,34.29 U$7.VMOT
N$28  (via drill 0.2)
  Top 0.1: v37.13,19.66 37.13,20.78 R9.1 | v37.69,16.26 38.46,15.49 D3.A
  Bottom 0.1: v37.13,19.66 37.13,16.82 v37.69,16.26
RESET  (via drill 0.2)
  Top 0.1: 35.31,4.06 U1.26 35.31,4.01 35.46,3.86 35.46,3.66 36.58,2.54 36.68,2.54 | v36.68,1.73 36.68,2.54 | v39.47,9.5 39.47,11.33 40.03,11.89 41,11.89 U$8.3 | 36.68,2.54 R1.1
  Bottom 0.1: v36.68,1.73 36.68,2.59 38.86,4.78 38.86,5.89 39.47,6.5 v39.47,9.5
RST  (via drill 0.2)
  Top 0.1: v23.27,33.43 29.31,33.43 29.72,33.83 39.32,33.83 45.06,28.09 45.06,16.26 44.65,15.85 44.65,11.63 39.12,6.1 39.12,4.57 38.25,4.57 38.05,4.78 38.05,5.38 36.98,5.38 U1.30 | U$7.RESET 9.5,31.09 9.5,36.47 9.8,36.78 v22.2,36.78
  Bottom 0.1: 23.06,33.43 23.01,33.43 22.61,33.83 20.57,33.83 20.12,33.38 20.12,26.87 U$6.RESET | v22.2,36.78 23.06,35.92 23.06,33.43 | 23.06,33.43 v23.27,33.43
RXD  (via drill 0.2)
  Top 0.1: v29.92,17.73 30.02,17.63 30.02,14.94 29.31,14.22 29.31,9.45 30.07,9.45 U1.3 | v39.88,11.12 41,11.12 41,10.97 U$8.2
  Bottom 0.1: v29.92,17.73 32.41,17.73 33.27,18.59 35.31,18.59 36.93,16.97 36.93,16.41 37.49,15.85 37.9,15.85 38.46,16.41 38.46,19.61 38.35,19.71 38.35,20.12 38.56,20.32 38.96,20.32 40.28,19 40.28,11.53 v39.88,11.12
SPARE-A1  (via drill 0.2)
  Top 0.1: v42.27,26.82 42.16,26.72 42.16,10.72 41.91,10.46 40.28,10.46 40.08,10.26 40.08,9.5 39.47,8.89 39.47,7.06 36.98,7.06 U1.34 | v17.22,28.96 13.41,28.96 13.41,28.09 11.68,26.36 11.68,18.19 U$9.1
  Bottom 0.1: v42.27,26.82 35.76,33.33 35.76,37.08 32.56,40.28 23.88,40.28 19.71,36.12 19.71,31.45 v17.22,28.96
SPARE-A2  (via drill 0.2)
  Top 0.1: v28.35,21.95 28.45,22.05 28.45,23.67 34.39,23.67 35.76,25.04 35.76,25.76 39.68,25.76 40.95,24.49 40.95,16.61 40.23,16.61 39.57,15.95 39.57,15.44 39.07,14.94 39.07,7.47 36.98,7.47 U1.35 | v20.32,19.51 17.98,21.84 17.98,23.22 17.07,24.13 13.72,24.13 13.72,18.95 11.99,17.22 10.67,17.22 10.67,18.14 U$9.2
  Bottom 0.1: v28.35,21.95 25.81,21.95 23.37,19.51 v20.32,19.51
SPARE-A3  (via drill 0.2)
  Top 0.1: v38.46,11.12 38.46,7.82 36.98,7.82 U1.36 | v39.68,12.34 39.47,12.55 39.47,13.82 40.49,14.83 41.86,14.83 41.86,27.23 37.74,31.34 v37.74,32.16 | v36.17,36.42 22.45,36.42 22.4,36.37 9.7,36.37 9.7,18.19 U$9.3
  Bottom 0.1: v39.68,12.34 v38.46,11.12 | v37.74,32.16 37.74,34.85 v36.17,36.42
SPARE-B1  (via drill 0.2)
  Top 0.1: v37.8,14.78 38.3,14.28 38.3,13.36 38.05,13.11 38.05,8.64 36.98,8.64 U1.38 | v29.62,17.17 29.46,17.02 29.46,15.65 U$10.1
  Bottom 0.1: v37.8,14.78 36.83,14.78 34.65,16.97 29.82,16.97 v29.62,17.17
SPARE-B2  (via drill 0.2)
  Top 0.1: v37.8,13.46 37.8,9.04 36.98,9.04 U1.39 | v28.96,16.76 28.45,16.26 U$10.2
  Bottom 0.1: v37.8,13.46 35.1,16.15 35.1,16.2 34.54,16.76 v28.96,16.76
SPARE-B3  (via drill 0.2)
  Top 0.1: v35.05,14.94 35.41,14.58 35.41,13.01 37.54,10.87 37.54,9.45 36.98,9.45 U1.40 | v27.69,14.48 27.48,14.68 27.48,15.6 U$10.3
  Bottom 0.1: v35.05,14.94 31.9,14.94 31.14,14.17 27.99,14.17 v27.69,14.48
STEP0  (via drill 0.2)
  Top 0.1: v36.32,3.4 36.17,3.4 35.87,3.71 35.87,4.06 35.76,4.17 U1.27 | v38.46,4.98 38.91,5.44 38.91,6.2 41.3,8.59 v41.3,9.25 | v41.3,15.9 41.35,15.95 41.35,26.31 41.25,26.42 26.82,26.42 v26.82,22.76
  Bottom 0.1: v36.32,3.4 36.88,3.4 v38.46,4.98 | v41.3,15.9 v41.3,9.25 | v26.82,22.76 26.31,22.76 23.88,20.32 U$6.STEP
STEP1  (via drill 0.2)
  Top 0.1: v27.18,5.89 27.28,5.79 27.28,4.22 30.89,4.22 U1.15
  Bottom 0.1: v27.18,5.89 18.95,5.89 16.51,8.33 11.89,8.33 5.28,14.94 5.28,18.85 U$7.STEP
TXD  (via drill 0.2)
  Top 0.1: v30.33,18.19 30.33,14.94 29.52,14.12 29.52,9.86 30.07,9.86 U1.2 | v42.57,25.55 42.37,25.35 42.37,10.62 41.71,9.96 41.05,9.96 U$8.1
  Bottom 0.1: v30.33,18.19 34.19,22.05 35.31,22.05 36.27,23.01 36.27,24.69 37.13,25.55 v42.57,25.55
USBDM  (via drill 0.2)
  Top 0.1: v32.36,16.1 32.97,16.1 34.8,14.28 34.8,11.18 34.9,11.07 U1.46 | v19.15,16.1 v19.96,16.1 | v11.94,8.89 11.73,8.69 11.73,8.08 R4.1
  Bottom 0.1: v19.96,16.1 v32.36,16.1 | v11.94,8.89 v19.15,16.1
USBDP  (via drill 0.2)
  Top 0.1: 34.54,11.43 34.54,11.18 U1.47 34.54,11.43 | 34.54,11.43 33.53,12.45 33.53,14.94 v32.82,15.65 | v19.15,14.28 v19.96,15.09 | v13.61,8.74 13.11,8.23 13.11,8.03 R5.1
  Bottom 0.1: v32.82,15.65 32.21,15.65 31.95,15.9 20.78,15.9 v19.96,15.09 | v13.61,8.74 v19.15,14.28
(copper drawn outside any net)
  shapes: Bottom area x1